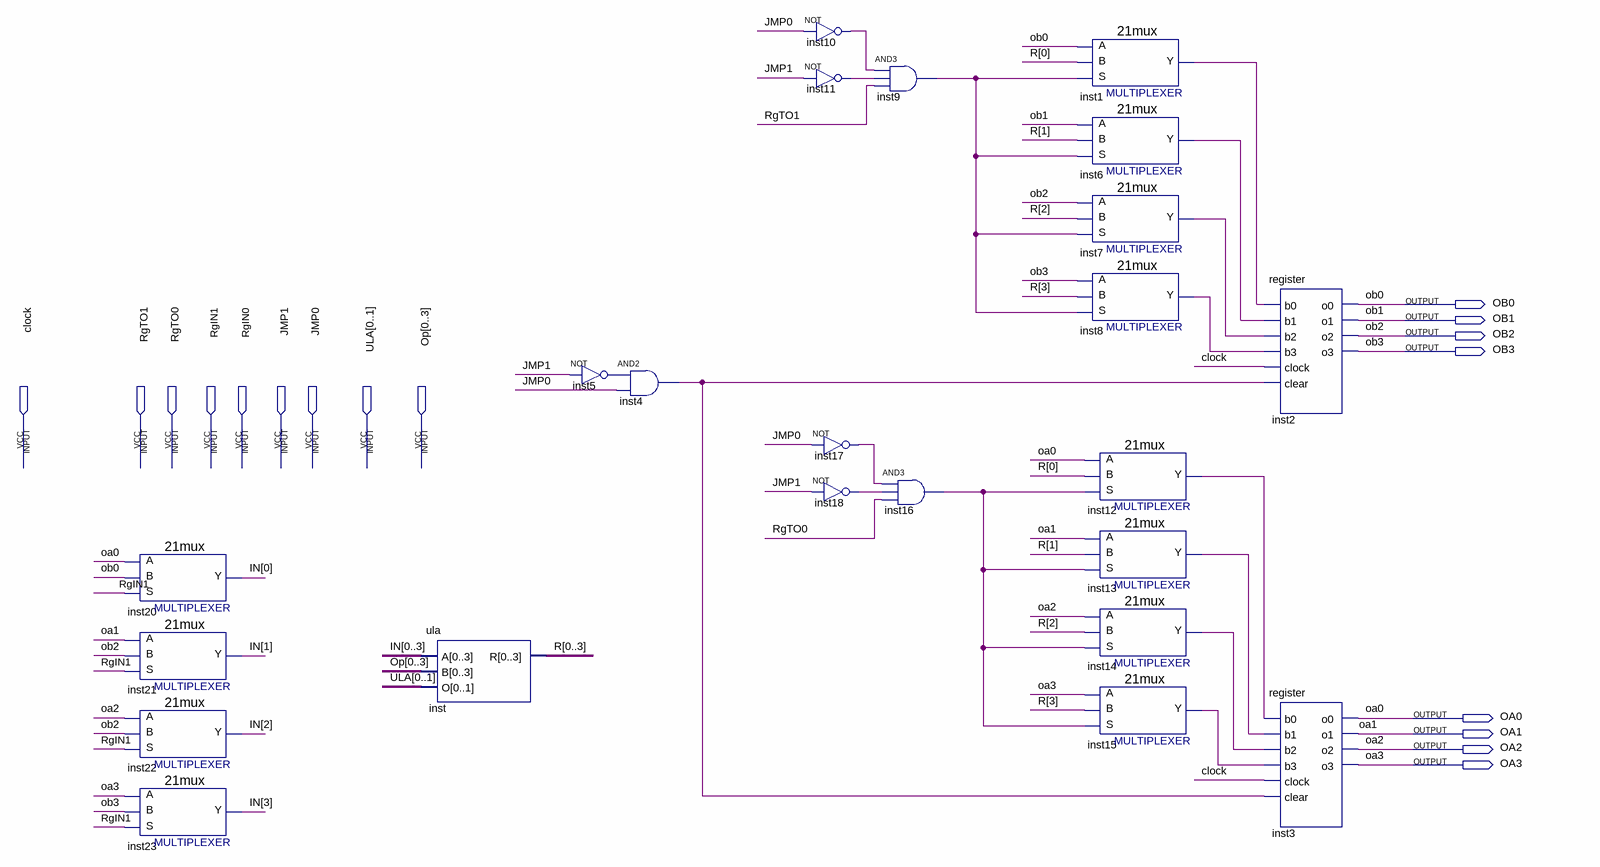
[diagram p0: schematic sheet]
// Quartus schematic control.bdf as structural Verilog: 23 symbols, 17 pins
module control (
  input  clock,
  input  RgTO1,
  input  RgTO0,
  input  RgIN1,
  input  RgIN0,
  input  JMP1,
  input  JMP0,
  input  [0:1] ULA,
  input  [0:3] Op,
  output OB0,
  output OB1,
  output OB2,
  output OB3,
  output OA0,
  output OA1,
  output OA2,
  output OA3
);

  wire inst1_y, inst4_out, inst5_out, inst6_y, inst7_y, inst8_y, inst9_out, inst10_out, inst11_out, inst12_y,
       inst13_y, inst14_y, inst15_y, inst16_out, inst17_out, inst18_out;
  wire [3:0] IN, R;

  \21mux  inst20 (.S(RgIN1), .B(OB0), .A(OA0), .Y(IN[0]));
  \21mux  inst21 (.S(RgIN1), .B(OB2), .A(OA1), .Y(IN[1]));
  \21mux  inst22 (.S(RgIN1), .B(OB2), .A(OA2), .Y(IN[2]));
  \21mux  inst23 (.S(RgIN1), .B(OB3), .A(OA3), .Y(IN[3]));
  ula inst (.A({IN[0], IN[1], IN[2], IN[3]}), .B(Op), .O(ULA), .R({R[0], R[1], R[2], R[3]}));
  not inst5 (inst5_out, JMP1);
  and inst4 (inst4_out, inst5_out, JMP0);
  not inst10 (inst10_out, JMP0);
  not inst11 (inst11_out, JMP1);
  not inst17 (inst17_out, JMP0);
  not inst18 (inst18_out, JMP1);
  and inst9 (inst9_out, inst10_out, inst11_out, RgTO1);
  and inst16 (inst16_out, inst17_out, inst18_out, RgTO0);
  \21mux  inst1 (.S(inst9_out), .B(R[0]), .A(OB0), .Y(inst1_y));
  \21mux  inst6 (.S(inst9_out), .B(R[1]), .A(OB1), .Y(inst6_y));
  \21mux  inst7 (.S(inst9_out), .B(R[2]), .A(OB2), .Y(inst7_y));
  \21mux  inst8 (.S(inst9_out), .B(R[3]), .A(OB3), .Y(inst8_y));
  \21mux  inst12 (.S(inst16_out), .B(R[0]), .A(OA0), .Y(inst12_y));
  \21mux  inst13 (.S(inst16_out), .B(R[1]), .A(OA1), .Y(inst13_y));
  \21mux  inst14 (.S(inst16_out), .B(R[2]), .A(OA2), .Y(inst14_y));
  \21mux  inst15 (.S(inst16_out), .B(R[3]), .A(OA3), .Y(inst15_y));
  register inst2 (
    .b0(inst1_y), .b1(inst6_y), .b2(inst7_y), .b3(inst8_y), .clock(clock), .clear(inst4_out), .o0(OB0),
    .o1(OB1), .o2(OB2), .o3(OB3));
  register inst3 (
    .b0(inst12_y), .b1(inst13_y), .b2(inst14_y), .b3(inst15_y), .clock(clock), .clear(inst4_out), .o0(OA0),
    .o1(OA1), .o2(OA2), .o3(OA3));
endmodule
